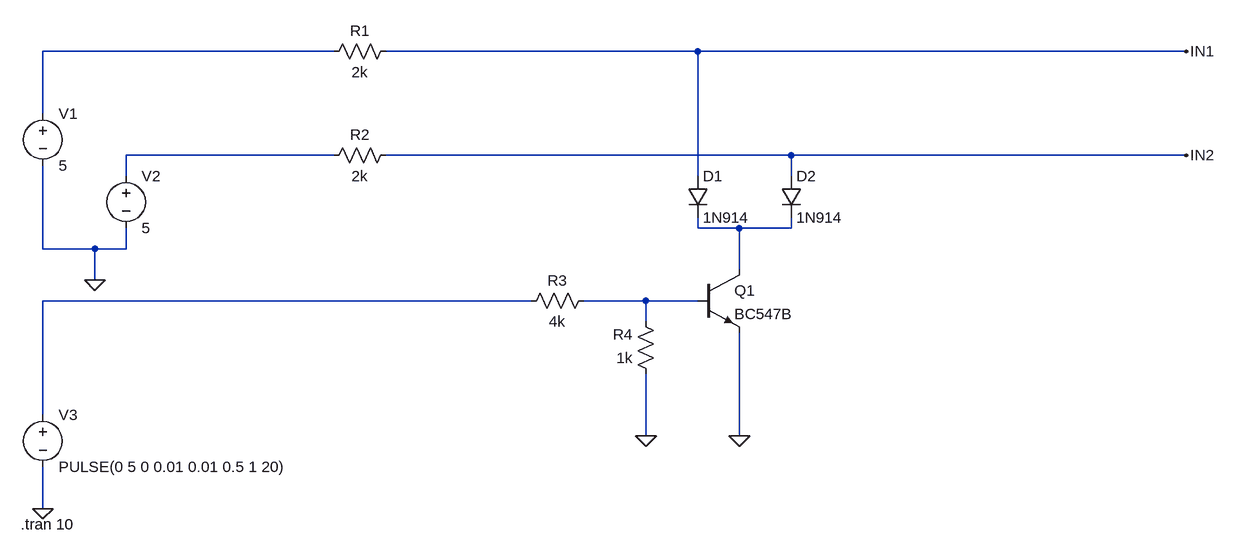
[diagram p0: schematic PWM_Trigger.asc]
PWM_Trigger.asc, the LTspice schematic file:
Version 4
SHEET 1 1908 712
WIRE 544 -32 96 -32
WIRE 1104 -32 624 -32
WIRE 1856 -32 1104 -32
WIRE 96 64 96 -32
WIRE 544 128 224 128
WIRE 1248 128 624 128
WIRE 1856 128 1248 128
WIRE 224 160 224 128
WIRE 1104 160 1104 -32
WIRE 1248 160 1248 128
WIRE 1104 240 1104 224
WIRE 1168 240 1104 240
WIRE 1248 240 1248 224
WIRE 1248 240 1168 240
WIRE 96 272 96 144
WIRE 176 272 96 272
WIRE 224 272 224 240
WIRE 224 272 176 272
WIRE 1168 304 1168 240
WIRE 176 320 176 272
WIRE 848 352 96 352
WIRE 1024 352 928 352
WIRE 1104 352 1024 352
WIRE 1024 384 1024 352
WIRE 96 528 96 352
WIRE 1024 560 1024 464
WIRE 1168 560 1168 400
WIRE 96 672 96 608
FLAG 176 320 0
FLAG 96 672 0
FLAG 1024 560 0
FLAG 1168 560 0
FLAG 1856 -32 IN1
FLAG 1856 128 IN2
SYMBOL voltage 96 48 R0
WINDOW 123 0 0 Left 2
WINDOW 39 0 0 Left 2
SYMATTR InstName V1
SYMATTR Value 5
SYMBOL voltage 224 144 R0
WINDOW 123 0 0 Left 2
WINDOW 39 0 0 Left 2
SYMATTR InstName V2
SYMATTR Value 5
SYMBOL voltage 96 512 R0
WINDOW 123 0 0 Left 2
WINDOW 39 0 0 Left 2
SYMATTR InstName V3
SYMATTR Value PULSE(0 5 0 0.01 0.01 0.5 1 20)
SYMBOL res 640 -48 R90
WINDOW 0 0 56 VBottom 2
WINDOW 3 32 56 VTop 2
SYMATTR InstName R1
SYMATTR Value 2k
SYMBOL res 640 112 R90
WINDOW 0 0 56 VBottom 2
WINDOW 3 32 56 VTop 2
SYMATTR InstName R2
SYMATTR Value 2k
SYMBOL res 944 336 R90
WINDOW 0 0 56 VBottom 2
WINDOW 3 32 56 VTop 2
SYMATTR InstName R3
SYMATTR Value 4k
SYMBOL res 1040 480 R180
WINDOW 0 36 76 Left 2
WINDOW 3 36 40 Left 2
SYMATTR InstName R4
SYMATTR Value 1k
SYMBOL npn 1104 304 R0
SYMATTR InstName Q1
SYMATTR Value BC547B
SYMBOL diode 1088 160 R0
SYMATTR InstName D1
SYMATTR Value 1N914
SYMBOL diode 1232 160 R0
SYMATTR InstName D2
SYMATTR Value 1N914
TEXT 62 696 Left 2 !.tran 10

The netlist it stands for:
* PWM_Trigger.asc
V1 N001 0 5
V2 N002 0 5
V3 N004 0 PULSE(0 5 0 0.01 0.01 0.5 1 20)
R1 IN1 N001 2k
R2 IN2 N002 2k
R3 N005 N004 4k
R4 0 N005 1k
Q1 N003 N005 0 0 BC547B
D1 IN1 N003 1N914
D2 IN2 N003 1N914
.model D D
.lib standard.dio
.model NPN NPN
.model PNP PNP
.lib standard.bjt
.tran 10
.backanno
.end

* Results of the author's LTspice run, read from the files saved beside the schematic
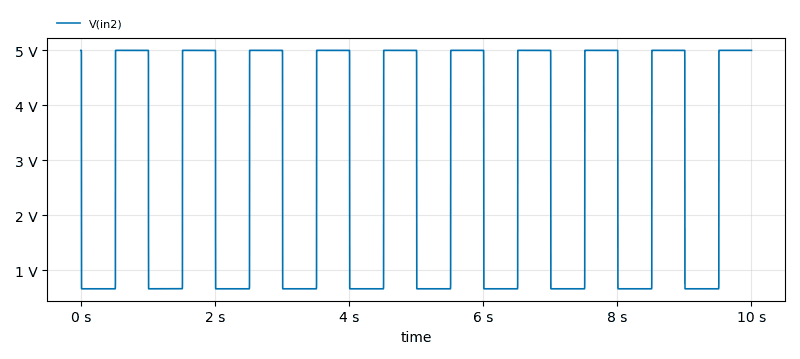
[diagram p1: Transient Analysis of PWM_Trigger.asc, plotted from the saved traces]
* Transient Analysis, 1 run:
*   V(in2): min 658.9 mV, max 5 V, average 2.8 V, rms 3.541 V, last 5 V